# EAGLE design 8600ACBIS (EAGLE 9.2.0)
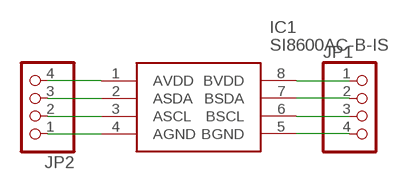
[diagram p0: schematic, sheet 1]

## Parts
IC1  SI8600AC-B-IS  [SOIC127P600X175-8N]
JP1  PINHD-1X4  [1X04]
JP2  PINHD-1X4  [1X04]

## Nets
N$1: IC1.1(AVDD) JP2.4
N$2: IC1.2(ASDA) JP2.3
N$3: IC1.3(ASCL) JP2.2
N$4: IC1.4(AGND) JP2.1
N$5: IC1.8(BVDD) JP1.1
N$6: IC1.7(BSDA) JP1.2
N$7: IC1.6(BSCL) JP1.3
N$8: IC1.5(BGND) JP1.4

## Library data of the parts
IC1 = Si8600AC-B-IS:SI8600AC-B-IS: Isolator,digital,I2C,1.7MHz,3.7kV,SOIC8N Silicon Labs Si8600AC-B-IS PCB SMT 2-channel I2C Digital Isolator, 3.75 kVrms, 8-Pin SOIC Source: Datasheet <http://docs-europe.electrocomponents.com/webdocs/10a3/0900766b810a3b8e.pdf>; ALLIED_NUMBER: R1015655; ALLIED_PRICE/STOCK: http://www.alliedelec.com/silicon-laboratories-si8600ac-b-is/R1015655/; ARROW_PART_NUMBER: Si8600AC-B-IS; ARROW_PRICE/STOCK: https://www.arrow.com/en/products/si8600ac-b-is/silicon-labs; DESCRIPTION: Isolator,digital,I2C,1.7MHz,3.7kV,SOIC8N Silicon Labs Si8600AC-B-IS PCB SMT 2-channel I2C Digital Isolator, 3.75 kVrms, 8-Pin SOIC; HEIGHT: 1.75mm; MANUFACTURER_NAME: Silicon Labs; MANUFACTURER_PART_NUMBER: Si8600AC-B-IS; RS_PART_NUMBER: 1689848; RS_PRICE/STOCK: http://uk.rs-online.com/web/p/products/1689848
JP1 JP2 = pinhead:PINHD-1X4: PIN HEADER

## Board
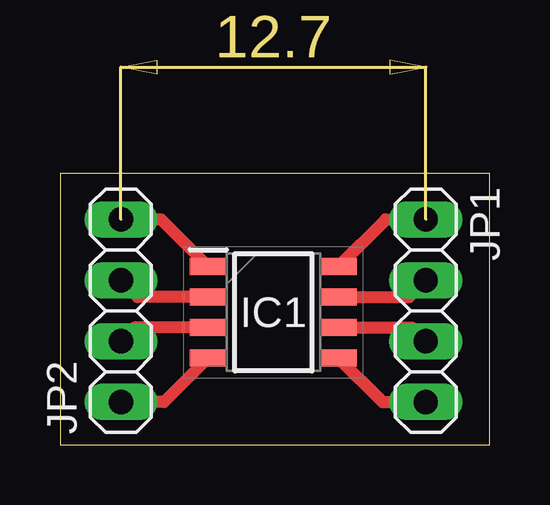
[diagram p1: board, top side]

Size 17.91 x 11.31 mm. Coordinates in mm from the lower left corner, seen from the top.
Outline: 0,0 17.91,0 17.91,11.31 0,11.31 0,0
Copper layers (1*16): Top 0.035mm / dielectric 1.5mm / Bottom 0.035mm
Design rules "default": minimum track width 6mil, minimum drill 0.35mm, track to track 6mil, track to pad 6mil, pad to pad 6mil, via to via 6mil, smd to smd 6mil, copper to edge 40mil, drill to drill 6mil, minimum pad ring 10mil, minimum via ring 8mil, stop-mask expansion 4mil, vias tented up to drill 0mil, thermal gap 10mil

### Footprints (pad centres in the part's own frame; a part is rotated, then mirrored left to right if it is on the bottom)
SOIC127P600X175-8N = smd 1.525 x 0.7: 1 -2.712,1.905; 2 -2.712,0.635; 3 -2.712,-0.635; 4 -2.712,-1.905; 5 2.712,-1.905; 6 2.712,-0.635; 7 2.712,0.635; 8 2.712,1.905
1X04 = drill 1.016 long: 1 -3.81,0; 2 -1.27,0; 3 1.27,0; 4 3.81,0

### Placement (x,y rotation side)
IC1  8.89,5.53 0 top
JP1  15.24,5.59 270 top
JP2  2.54,5.59 90 top

### Tracks (layer width: path | path; a pad name or v marks a point on that pad's centre or on a via)
N$1
  Top 0.508: IC1.1 4.21,9.4 JP2.4
N$2
  Top 0.508: IC1.2 3.24,6.16 JP2.3
N$3
  Top 0.508: IC1.3 3.11,4.89 JP2.2
N$4
  Top 0.508: IC1.4 4.34,1.78 JP2.1
N$5
  Top 0.508: IC1.8 13.57,9.4 JP1.1
N$6
  Top 0.508: IC1.7 14.54,6.16 JP1.2
N$7
  Top 0.508: IC1.6 14.67,4.89 JP1.3
N$8
  Top 0.508: IC1.5 13.44,1.78 JP1.4